# EasyEDA Pro project PowerStack.epro, board PCB1
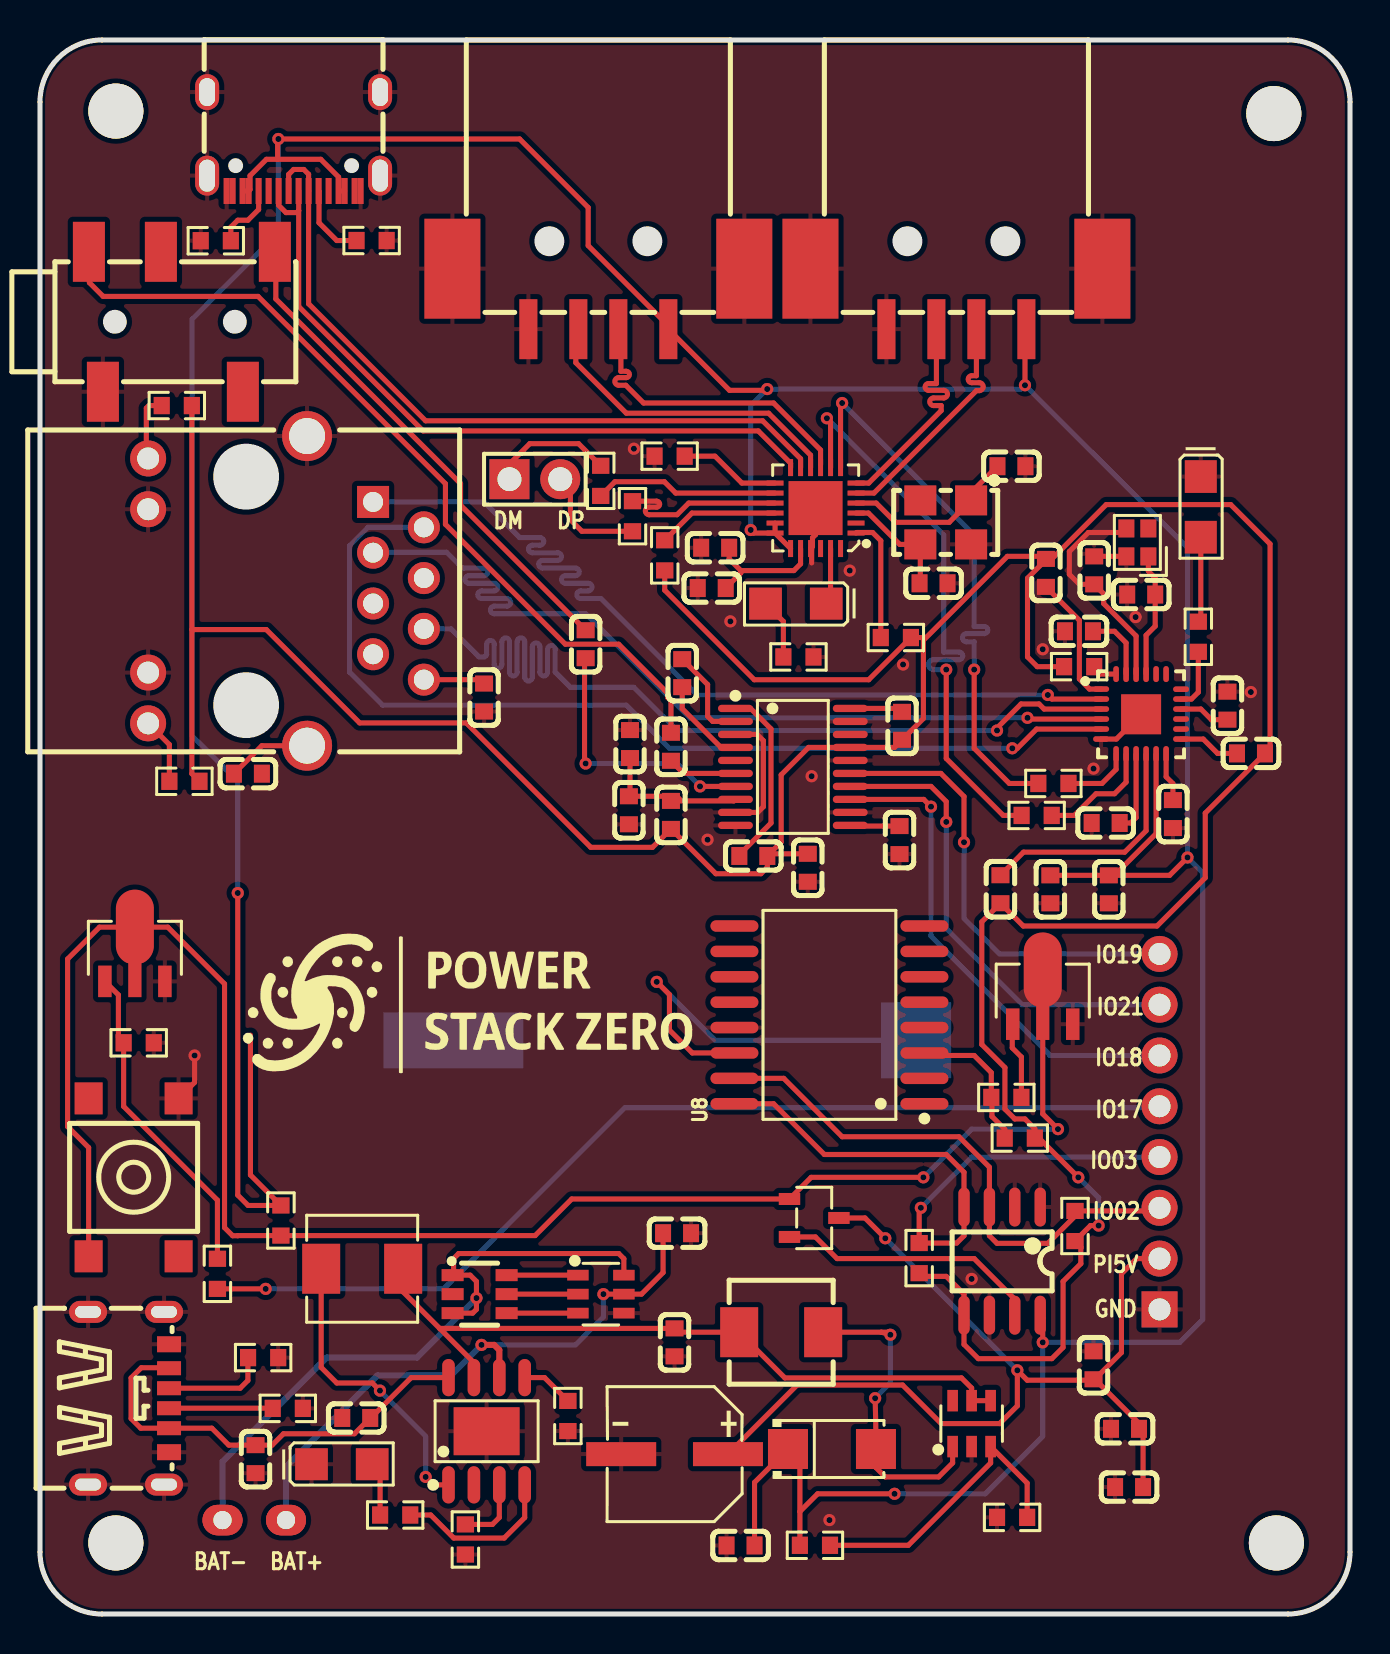
[diagram p1: board, top side]
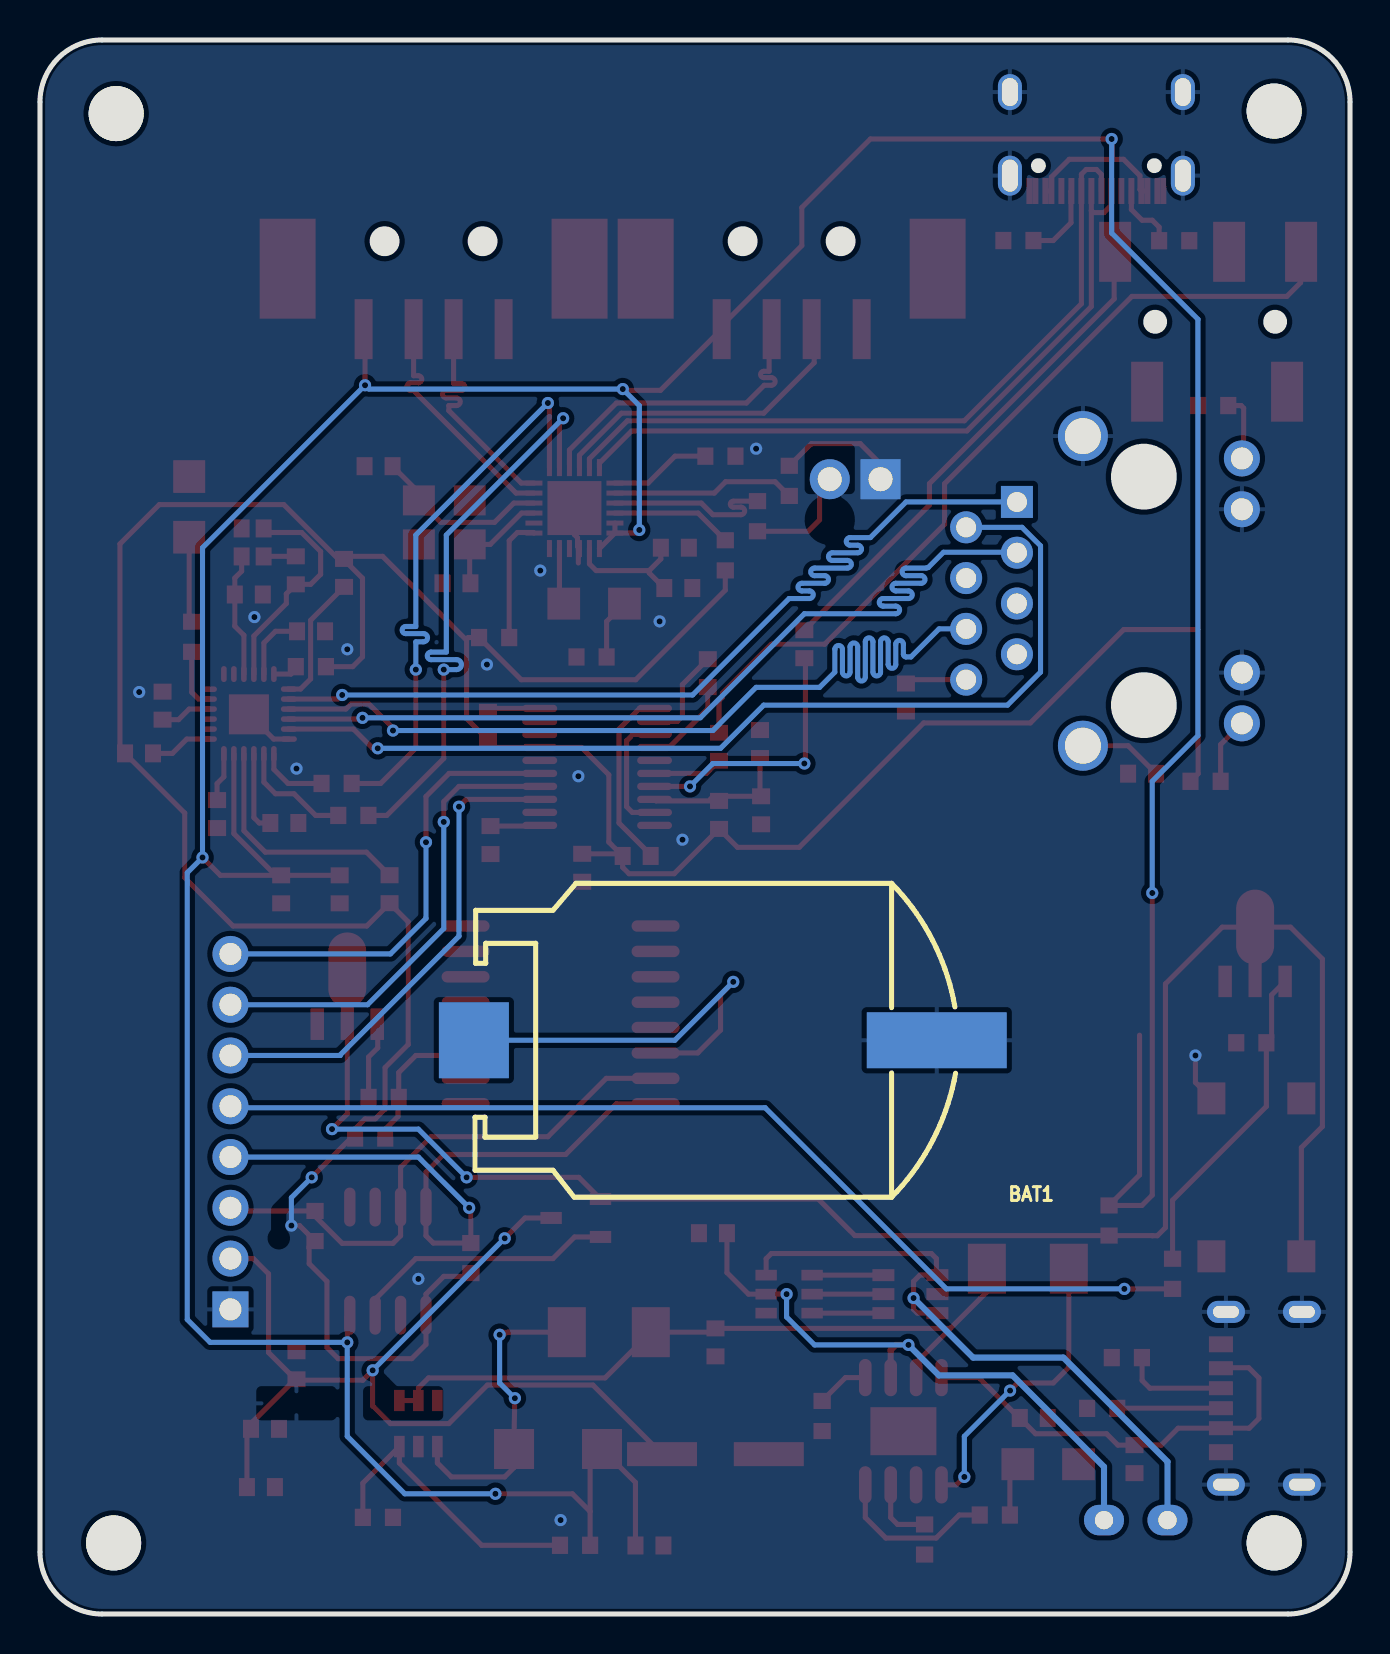
[diagram p2: board, bottom side, seen from below]

Outline 65.52 x 78.74 mm; copper layers: Top Layer, Bottom Layer. Coordinates in mm from the lower left corner of the outline.
Outline path: 0,75.64 0,3.1 arc(0.91,0.91) 3.1,0 62.42,0 arc(64.61,0.91) 65.52,3.1 65.52,75.64 arc(64.61,77.83) 62.42,78.74 3.1,78.74 arc(0.91,77.83) 0,75.64
Stack: Top Layer 0.035mm / Dielectric1 1.51mm FR4 er 4.5 / Bottom Layer 0.035mm

## Design rules (mm)
template: JLCPCB Capability(Two Layers Board)
spacing copperThickness1oz (default): track to track 0.102, other pairs 0.152 to 0.3
spacing copperThickness2oz: track to track 0.203, other pairs 0.152 to 0.3
track width copperThickness1oz (default): min 0.127, default 0.254, max 2.54
track width copperThickness2oz: min 0.203, default 0.254, max 2.54
differential pair differentialPair (default): width min 0.127, default 0.254, max 2.54; gap min 0.152, default 0.152
via viaSize (default): diameter min 0.5, default 0.61, max 10; hole min 0.3, default 0.305, max 6.3

## Placement (name value [footprint] x y rotation side)
BAT1  BS-CR2032-8  [BAT-SMD_BS-CR2032-8]  32.24 28.7 0 bottom
C1  10uF  [C0603]  10.78 7.75 270 top
C2  22uF  [C0603]  15.82 9.81 180 top
C3  10uF  [C0603]  31.73 13.59 270 top
C4  100nF  [C0603]  31.86 19.05 180 top
C5  100nF  [C0603]  54.26 9.27 0 top
C6  10uF  [C0603]  54.47 6.35 180 top
C7  100nF  [C0603]  35.04 3.43 0 top
C8  100nF  [C0603]  52.69 12.44 270 top
C9  470uF  [CAP-SMD_BD6.3-L6.6-W6.6-FD]  31.74 8 180 top
C10  100nF  [C0603]  33.77 53.34 0 top
C11  10uF  [C0603]  33.6 51.32 180 top
C12  22pF  [C0603]  48.58 57.42 180 top
C13  22pF  [C0603]  44.69 51.56 180 top
C14  1uF  [C0603]  53.3 39.57 0 top
C15  100nF  [C0603]  22.21 45.85 270 top
C16  22pF  [C0603]  55.07 51 0 top
C17  22pF  [C0603]  52.72 52.21 270 top
C18  1uF  [C0603]  56.66 40.02 90 top
C19  1uF  [C0603]  51.96 49.16 0 top
C20  1uF  [C0603]  59.39 45.44 270 top
C21  1uF  [C0603]  10.4 42.04 180 top
C22  100nF  [C0603]  50.53 36.25 90 top
C23  10uF  [C0603]  53.45 36.25 270 top
C24  100nF  [C0603]  48.03 36.26 270 top
C25  100nF  [C0603]  60.56 43.05 180 top
C26  100nF  [C0603]  50.31 52.08 90 top
C27  100nF  [C0603]  31.56 39.98 270 top
C28  100nF  [C0603]  43.11 44.43 270 top
C29  1uF  [C0603]  35.67 37.92 0 top
C30  10uF  [C0603]  38.4 37.33 270 top
C31  1uF  [C0603]  42.99 38.72 270 top
C32  2.2uF  [C0603]  31.56 43.38 270 top
C33  2.2uF  [C0603]  27.29 48.51 270 top
C34  100nF  [C0603]  29.51 43.52 270 top
C35  1uF  [C0603]  29.45 40.21 270 top
C36  1uF  [C0603]  32.12 47.07 90 top
CN1  PJ-327A  [AUDIO-SMD_XUNPU_PJ-327A]  7.1 64.64 0 top
D1  SS34  [SMA_L4.3-W2.6-LS5.1-RD]  39.61 8.25 0 top
H1  PZ254V-11-02P  [HDR-TH_2P-P2.54-V-M]  24.75 56.77 0 top
H2  PZ254R-11-08P  [HDR-TH_8P-P2.54-H-M-W10.4]  55.99 24.13 90 top
J1  HR911105A  [RJ45-TH_HR911105A]  12.3 51.18 270 top
L1  2.2uH  [IND-SMD_L5.4-W5.2]  16.11 17.27 0 top
L2  10uH  [IND-SMD_L5.2-W5.2_MCW-0530]  37.07 14.1 0 top
NOREF  -  [Pad_e1323]  3.79 75.18 0 top
NOREF#2  -  [Pad_e1324]  61.71 75.06 0 top
NOREF#3  -  [Pad_e347]  9.13 4.7 180 top
NOREF#4  -  [Pad_e346]  12.3 4.7 180 top
NOREF#5  -  [Pad_e343]  12.3 4.7 180 top
NOREF#6  -  [Pad_e348]  9.13 4.7 180 top
NOREF#7  -  [Pad_e768]  61.83 3.56 0 top
NOREF#8  -  [Pad_e160]  3.79 3.56 0 top
Q1  FS8205A  [SOT-23-6_L2.9-W1.6-P0.95-LS2.8-BR]  21.99 16 180 top
Q2  AO3407  [SOT-23-3_L2.9-W1.6-P1.90-LS2.8-BR]  38.72 19.81 180 top
Q3  2N2222AU  [SOT-89-3_L4.5-W2.4-P1.50-LS4.0-BR]  4.75 33 270 top
Q4  2N2222AU  [SOT-89-3_L4.5-W2.4-P1.50-LS4.0-BR]  50.15 30.86 270 top
R1  10kΩ  [R0603_NEW]  21.27 3.73 90 top
R2  1.8kΩ  [R0603_NEW]  26.4 9.91 90 top
R3  1kΩ  [R0603_NEW]  17.76 4.95 0 top
R5  100kΩ  [R0603_NEW]  38.76 3.44 180 top
R6  20kΩ  [R0603_NEW]  48.62 4.83 0 top
R7  4.7kΩ  [R0603_NEW]  43.97 17.8 270 top
R8  4.7kΩ  [R0603_NEW]  51.76 19.41 90 top
R9  100kΩ  [R0603_NEW]  12.05 19.69 90 top
R10  1kΩ  [R0603_NEW]  8.87 17.02 90 top
R11  10kΩ  [R0603_NEW]  4.94 28.58 180 top
R12  10kΩ  [R0603_NEW]  49 23.81 180 top
R13  1kΩ  [R0603_NEW]  48.33 25.84 0 top
R14  22Ω  [R0603_NEW]  28.04 56.69 270 top
R15  22Ω  [R0603_NEW]  29.63 54.92 90 top
R16  10kΩ  [R0603_NEW]  31.24 52.96 90 top
R17  2.7kΩ  [R0603_NEW]  31.49 57.92 180 top
R18  10kΩ  [R0603_NEW]  42.8 48.85 180 top
R19  1kΩ  [R0603_NEW]  37.93 47.88 0 top
R20  1kΩ  [R0603_NEW]  57.93 48.89 270 top
R21  1kΩ  [R0603_NEW]  6.84 60.45 0 top
R22  1kΩ  [R0603_NEW]  7.22 41.66 0 top
R23  10kΩ  [R0603_NEW]  51.97 47.39 180 top
R24  22Ω  [R0603_NEW]  50.68 41.55 180 top
R25  22Ω  [R0603_NEW]  49.84 39.95 180 top
SW2  B3FS-1000P  [KEY-SMD_4P-L6.0-W6.3-P4.50-LS8.0]  4.68 21.84 90 top
U1  ETA6002E8A  [ESOP-8_L4.9-W3.9-P1.27-LS6.0-BL-EP-1]  22.34 9.14 0 top
U2  MT3608  [SOT-23-6_L2.9-W1.6-P0.95-LS2.8-BL]  46.59 9.53 0 top
U3  INA219BIDR  [SOIC-8_L5.0-W4.0-P1.27-LS6.1-BL]  48.12 17.65 180 top
U4  YLED1206G  [LED1206-RD]  15.1 7.49 0 top
U5  5.1kΩ  [R0603_NEW]  11.16 12.83 180 top
U6  5.1kΩ  [R0603_NEW]  12.39 10.29 180 top
U7  DW01A  [SOT-23-6_L2.9-W1.6-P0.95-LS2.8-BL]  28.05 16 270 top
U8  DS3231SN#T&R  [SOIC-16_L10.3-W7.5-P1.27-LS10.3-BL]  39.48 29.97 90 top
U9  FE1.1S-BQFN24B  [WQFN-24_L4.0-W4.0-P0.50-TL-EP2.7]  38.79 55.32 180 top
U10  5.1kΩ  [R0603_NEW]  8.79 68.7 0 top
U11  5.1kΩ  [R0603_NEW]  16.58 68.71 0 top
U12  RTL8152B  [QFN-24_L4.0-W4.0-P0.50-BL-EP2.0]  55.07 45.02 270 top
U14  YLED1206R  [LED1206-FD]  37.8 50.54 0 top
U15  YLED1206G  [LED1206-RD]  58.05 55.38 270 top
U16  PCM5102APWR  [TSSOP-20_L6.5-W4.4-P0.65-LS6.4-BL]  37.65 42.38 270 top
U17  25MHz  [CRYSTAL-SMD_4P-L2.0-W1.6-BL]  54.88 53.61 90 top
USB1  TYPE-C 6P  [TYPE-C-SMD_TYPE-C-6P_1]  4.43 10.8 270 top
USB2  USB-234-BCW  [USB-A-SMD_USB-234-BCW]  27.92 65.79 180 top
USB4  USB-234-BCW  [USB-A-SMD_USB-234-BCW]  45.83 65.79 180 top
USB5  TYPE C  [USB-C_SMD-TYPE-C-31-M-12]  12.68 73.66 180 top
X1  12MHz  [OSC-SMD_4P-L5.0-W3.2-BL_SG5032]  45.3 54.61 180 top

## Footprints (pads in the part's own frame, mm; a bottom-side part is the same pattern mirrored in y, then rotated)
AUDIO-SMD_XUNPU_PJ-327A
  rect 1.6x3 smd: 2(-4.65,3.5) 3(4.65,3.5) 4(3.05,-3.5) 5(-3.95,-3.5) 6(-1.05,3.5)
BAT-SMD_BS-CR2032-8
  rect 7x2.8 smd: 1(-11.575,0)
  rect 3.5x3.8 smd: 2(11.575,0)
C0603
  rect 0.8x0.9 smd: 1(-0.7,0) 2(0.7,0)
CAP-SMD_BD6.3-L6.6-W6.6-FD
  rect 3.5x1.2 smd: 1(-2.67,0) 2(2.67,0)
CRYSTAL-SMD_4P-L2.0-W1.6-BL
  rect 0.9x0.8 smd: 1(-0.7,-0.55) 2(0.7,-0.55) 3(0.7,0.55) 4(-0.7,0.55)
ESOP-8_L4.9-W3.9-P1.27-LS6.0-BL-EP-1
  oval 0.63x1.865 smd: 1(-1.905,-2.683) 2(-0.635,-2.683) 3(0.635,-2.683) 4(1.905,-2.683) 5(1.905,2.683) 6(0.635,2.683) 7(-0.635,2.683) 8(-1.905,2.683)
  rect 3.3x2.4 smd: 9(0,0)
HDR-TH_2P-P2.54-V-M
  rect 2x2 hole 1.2: 1(-1.27,0)
  round 2 hole 1.2: 2(1.27,0)
HDR-TH_8P-P2.54-H-M-W10.4
  rect 1.8x1.8 hole 1.1: 1(-8.89,0)
  round 1.8 hole 1.1: 2(-6.35,0) 3(-3.81,0) 4(-1.27,0) 5(1.27,0) 6(3.81,0) 7(6.35,0) 8(8.89,0)
IND-SMD_L5.2-W5.2_MCW-0530
  rect 1.9x2.5 smd: 1(-2.1,0) 2(2.1,0)
IND-SMD_L5.4-W5.2
  rect 1.9x2.5 smd: 1(2.05,0) 2(-2.05,0)
KEY-SMD_4P-L6.0-W6.3-P4.50-LS8.0
  rect 1.6x1.4 smd: 1(3.95,-2.25) 2(-3.95,-2.25) 3(3.95,2.25) 4(-3.95,2.25)
LED1206-FD
  rect 1.635x1.6 smd: 1(-1.518,0) 2(1.518,0)
LED1206-RD
  rect 1.635x1.6 smd: 1(-1.518,0) 2(1.518,0)
OSC-SMD_4P-L5.0-W3.2-BL_SG5032
  rect 1.6x1.5 smd: 1(-1.27,-1.1) 2(1.27,-1.1) 3(1.27,1.1) 4(-1.27,1.1)
Pad_e160
  round 2.75 hole 2.75: None(0,0)
Pad_e343
  oval 2x1.524 hole 0.914: 1(0,0)
Pad_e346
  oval 2x1.524 smd: 1(0,0)
Pad_e347
  oval 2x1.524 hole 0.914: 1(0,0)
Pad_e348
  oval 2x1.524 smd: 1(0,0)
Pad_e768
  round 2.75 hole 2.75: None(0,0)
Pad_e1323
  round 2.75 hole 2.75: None(0,0)
Pad_e1324
  round 2.75 hole 2.75: None(0,0)
QFN-24_L4.0-W4.0-P0.50-BL-EP2.0
  oval 0.28x0.8 smd: 1(-1.25,-2) 2(-0.75,-2) 3(-0.25,-2) 4(0.25,-2) 5(0.75,-2) 6(1.25,-2) 13(1.25,2) 14(0.75,2) 15(0.25,2) 16(-0.25,2) 17(-0.75,2) 18(-1.242,2)
  oval 0.8x0.28 smd: 7(2,-1.25) 8(2,-0.75) 9(2,-0.25) 10(2,0.25) 11(2,0.75) 12(2,1.25) 19(-2,1.25) 20(-2,0.75) 21(-2,0.25) 22(-2,-0.25) 23(-2,-0.75) 24(-2,-1.25)
  rect 2x2 smd: 25(0.013,0)
R0603_NEW
  rect 0.806x0.864 smd: 1(-0.753,0) 2(0.753,0)
RJ45-TH_HR911105A
  rect 1.6x1.6 hole 1: 1(-4.45,4.355)
  round 1.6 hole 1: 2(-3.18,6.895) 3(-1.91,4.355) 4(-0.64,6.895) 5(0.63,4.355) 6(1.9,6.895) 7(3.17,4.355) 8(4.44,6.895)
  round 1.8 hole 1.1: 9(-6.625,-6.895) 10(-4.085,-6.895) 11(4.085,-6.895) 12(6.625,-6.895)
  round 2.5 hole 1.8: SH1(-7.745,1.055) SH2(7.745,1.055)
SMA_L4.3-W2.6-LS5.1-RD
  rect 2x2 smd: 1(-2.2,0) 2(2.2,0)
SOIC-8_L5.0-W4.0-P1.27-LS6.1-BL
  oval 0.569x1.95 smd: 1(-1.905,-2.705) 2(-0.635,-2.705) 3(0.635,-2.705) 4(1.905,-2.705) 5(1.905,2.705) 6(0.635,2.705) 7(-0.635,2.705) 8(-1.905,2.705)
SOIC-16_L10.3-W7.5-P1.27-LS10.3-BL
  oval 0.574x2.401 smd: 1(-4.445,-4.75) 2(-3.175,-4.75) 3(-1.905,-4.75) 4(-0.635,-4.75) 5(0.635,-4.75) 6(1.905,-4.75) 7(3.175,-4.75) 8(4.445,-4.75) 9(4.445,4.75) 10(3.175,4.75) 11(1.905,4.75) 12(0.635,4.75) 13(-0.635,4.75) 14(-1.905,4.75) 15(-3.175,4.75) 16(-4.445,4.75)
SOT-23-3_L2.9-W1.6-P1.90-LS2.8-BR
  rect 1.07x0.6 smd: 1(1.235,-0.95) 2(1.235,0.95) 3(-1.235,0)
SOT-23-6_L2.9-W1.6-P0.95-LS2.8-BL
  rect 0.532x1.072 smd: 1(-0.95,-1.149) 2(0,-1.149) 3(0.95,-1.149) 4(0.95,1.149) 5(0,1.149) 6(-0.95,1.149)
SOT-23-6_L2.9-W1.6-P0.95-LS2.8-BR
  rect 1.1x0.6 smd: 1(1.35,-0.95) 2(1.35,0) 3(1.35,0.95) 4(-1.35,0.95) 5(-1.35,0) 6(-1.35,-0.95)
SOT-89-3_L4.5-W2.4-P1.50-LS4.0-BR
  rect 1.575x0.672 smd: 1(1.357,-1.5) 3(1.357,1.5)
  custom 5.377x1.9 smd: 2(-1.357,-0.001)
TSSOP-20_L6.5-W4.4-P0.65-LS6.4-BL
  oval 0.364x1.742 smd: 1(-2.925,-2.871) 2(-2.275,-2.871) 3(-1.625,-2.871) 4(-0.975,-2.871) 5(-0.325,-2.871) 6(0.325,-2.871) 7(0.975,-2.871) 8(1.625,-2.871) 9(2.275,-2.871) 10(2.925,-2.871) 11(2.925,2.871) 12(2.275,2.871) 13(1.625,2.871) 14(0.975,2.871) 15(0.325,2.871) 16(-0.325,2.871) 17(-0.975,2.871) 18(-1.625,2.871) 19(-2.275,2.871) 20(-2.925,2.871)
TYPE-C-SMD_TYPE-C-6P_1
  oval 1.1x1.9 hole 0.6x1.3: 7(-4.32,1.775) 7(-4.32,-2.025) 7(4.32,1.775) 7(4.32,-2.025)
  rect 0.7x1.2 smd: A5(-0.5,2.025) A9(1.5,2.025) B5(0.5,2.025) B9(-1.5,2.025)
  rect 0.8x1.2 smd: A12(2.7,2.025) B12(-2.7,2.025)
USB-A-SMD_USB-234-BCW
  rect 0.9x3 smd: 1(-3.5,1.512) 2(-1,1.512) 3(1,1.512) 4(3.5,1.512)
  rect 2.8x5 smd: 5(-7.3,-1.512) 6(7.3,-1.512)
USB-C_SMD-TYPE-C-31-M-12
  oval 1.2x2 hole 0.8x1.6: 0(-4.325,1.706) 1(4.325,1.706)
  oval 1.2x1.8 hole 0.8x1.4: 2(4.325,-2.474) 3(-4.325,-2.474)
  rect 0.3x1.3 smd: A1(-3.35,2.474) A4(-2.55,2.474) A5(-1.25,2.474) A6(-0.25,2.474) A7(0.25,2.474) A8(1.25,2.474) A9(2.55,2.474) A12(3.35,2.474) B1(3.05,2.474) B4(2.25,2.474) B5(1.75,2.474) B6(0.75,2.474) B7(-0.75,2.474) B8(-1.75,2.474) B9(-2.25,2.474) B12(-3.05,2.474)
WQFN-24_L4.0-W4.0-P0.50-TL-EP2.7
  rect 0.85x0.25 smd: 1(-2.025,1.25) 2(-2.025,0.75) 3(-2.025,0.25) 4(-2.025,-0.25) 5(-2.025,-0.75) 6(-2.025,-1.25) 13(2.025,-1.25) 14(2.025,-0.75) 15(2.025,-0.25) 16(2.025,0.25) 17(2.025,0.75) 18(2.025,1.25)
  rect 0.25x0.85 smd: 7(-1.25,-2.025) 8(-0.75,-2.025) 9(-0.25,-2.025) 10(0.25,-2.025) 11(0.75,-2.025) 12(1.25,-2.025) 19(1.25,2.025) 20(0.75,2.025) 21(0.25,2.025) 22(-0.25,2.025) 23(-0.75,2.025) 24(-1.25,2.025)
  rect 2.7x2.7 smd: 25(0.001,0)

## Nets
As in the schematic, except:
BAT+: C4.2 NOREF#4.1 NOREF#5.1 U1.6 U7.5
BAT-: NOREF#3.1 NOREF#6.1 Q1.1 Q1.3 U7.6

Pads without a net: C18 2; C21 1 2; CN1 4 6; J1 4 5 7; NOREF None; NOREF#2 None; NOREF#7 None; NOREF#8 None; Q1 2; SW2 2 3; U2 6; U8 1 2 4 5 6 7 8 9 10 11 12; U9 2 22 24; U12 14 15 18 19 20; U16 5 18; U17 2; USB5 A8 B8; X1 2

## Via types
v1: diameter 0.61, hole 0.305, Top Layer to Bottom Layer, 50 vias

## Routing (per net, layer and track width the routed paths; a pad name or vN(x,y) marks a point on that pad's centre or on a via; arc(x,y) is an arc through that point)
5V_OUT: length 236.2
  Top Layer w0.254: 11.88,72.77 11.88,73.75 v1(11.92,73.79) ; 11.88,72.77 14.04,72.77 14.93,71.88 USB5.B9 USB5.A4 ; 11.88,72.77 11.33,72.77 10.51,71.95 10.51,71.26 USB5.B4 USB5.A9 ; 53.73,36.95 C22.2 ; 53.73,36.95 56.49,36.95 v1(57.39,37.85) ; 53.73,36.95 55.82,39.04 U12.11 ; v1(49.26,61.47) 49.26,64.2 USB4.1 ; U9.18 U9.19 ; U9.18 35.7,54.07 v1(35.54,54.23) ; U9.18 U9.17 ; v1(36.37,61.28) 36.31,61.21 34.48,61.21 USB2.1 31.42,64.45 27.42,68.45 27.42,70.36 23.99,73.79 v1(11.92,73.79) ; 11.84,73.79 v1(11.92,73.79) ; R5.2 38,5.13 ; 38,5.13 38.89,6.01 v1(42.74,6.01) ; 38,5.13 38,8.25 37.41,8.25 35.74,6.58 C7.2 ; v1(9.89,36.07) 9.89,20.96 10.41,20.44 R9.2 10.52,21.96 10.52,28.96 ; v1(50.15,13.59) 50.15,14.82 U3.8
  Bottom Layer w0.254: v1(35.54,54.23) 35.54,60.45 v1(36.37,61.28) 49.07,61.28 v1(49.26,61.47) 57.39,53.34 v1(57.39,37.85) 58.15,37.08 58.15,14.73 57.01,13.59 v1(50.15,13.59) 50.15,8.89 47.27,6.01 v1(42.74,6.01) ; v1(9.89,36.07) 9.89,41.66 7.6,43.94 7.6,64.77 11.92,69.09 v1(11.92,73.79)
+5V: length 22
  Top Layer w0.254: USB1.B9 6.43,12.32 5.06,12.32 4.56,11.81 4.56,9.78 5.04,9.3 USB1.A9 8.6,9.3 9.44,8.45 C1.1 11.61,8.45 12.18,9.02 15.73,9.02 C2.1 16.54,9.81 18.56,11.83 U1.8
AVDD: length 7.8
  Top Layer w0.254: 31.99,40.77 31.85,40.91 C35.1 29.51,40.96 C34.2 ; C27.1 34.7,40.68 U16.8
GND: length 15.8
  Top Layer w0.254: C17.1 54.33,52.91 U17.4 ; U9.25 38.79,53.99 38.63,53.84 38.63,53.4 U9.21 38.59,53.24 38.59,52.58 ; SW2.1 7.73,26.59 v1(7.73,27.94) ; U16.3 35.87,44 36.18,43.69 36.18,40.39 35.89,40.1 U16.9 ; U12.6 53.83,43.77 U12.25
  vias: v1(29.7,58.29) v1(33.39,38.73) v1(34.53,49.66) v1(38.59,41.91) v1(39.48,4.7) v1(40.5,52.2) v1(43.16,47.5) v1(46.59,16.76) v1(50.15,48.26) v1(52.69,42.29) v1(54.79,49.87) v1(60.56,46.12)
(no net): length 6.9
  Top Layer w0.254: 13.36,43.44 11.1,43.44 9.7,42.04 ; 56.32,43.23 56.32,41.88 56.66,41.54 C18.2
BAT+: length 30.6
  Top Layer w0.254: C4.2 31.16,17.08 30.08,16 U7.5 v1(28.18,16)
  Top Layer w0.305: v1(22.08,13.46) 22.72,13.46 22.97,13.21 U1.6
  Bottom Layer w0.254: v1(22.08,13.46) 26.78,13.46 28.18,14.86 v1(28.18,16)
  Bottom Layer w0.305: NOREF#4.1 12.3,7.37 16.88,11.94 20.56,11.94 v1(22.08,13.46)
BAT-: length 33.4
  Top Layer w0.254: U7.6 29.2,17.77 28.94,18.03 20.94,18.03 20.69,17.78 20.69,17 Q1.1 21.51,16.95 21.83,16.64 v1(21.83,15.81) 21.83,15.24 21.64,15.05 Q1.3
  Bottom Layer w0.305: NOREF#3.1 9.13,7.62 14.33,12.83 18.85,12.83 v1(21.83,15.81)
DM1: length 36.8
  Top Layer w0.254: U9.11 38.04,57.79 36.14,59.69 19.29,59.69 13.43,65.54 USB5.B7 13.43,72.02 13.19,72.26 12.68,72.26 12.43,72.01 USB5.A7
DM2: length 16.1
  Top Layer w0.254: 39.04,57.51 39.04,58.23 36.69,60.58 30.19,60.58 29.3,61.47 28.94,61.47 arc(28.75,61.66) 28.94,61.85 29.32,61.85 arc(29.48,62.01) 29.32,62.17 29.05,62.17 29.05,64.15 USB2.2
DM3: length 29.4
  Top Layer w0.254: U9.7 40.04,60.5 v1(40.12,60.58) ; v1(46.72,47.24) 46.72,43.31 48.48,41.55 49.93,41.55
  Bottom Layer w0.254: v1(46.72,47.24) 46.72,48.63 46.34,48.63 arc(46.13,48.84) 46.34,49.04 47.23,49.04 arc(47.41,49.22) 47.23,49.4 46.72,49.4 46.72,53.98 v1(40.12,60.58)
DM4: length 12.5
  Top Layer w0.254: 46.83,64.38 46.83,61.94 46.59,61.94 arc(46.42,61.77) 46.59,61.59 46.97,61.59 arc(47.17,61.4) 46.97,61.2 46.83,61.2 41.71,56.07 U9.5
DP1: length 35.8
  Top Layer w0.254: 12.94,70.2 12.94,65.41 19.16,59.18 35.92,59.18 37.54,57.57 U9.12 ; 12.94,70.2 12.94,71.18 USB5.A6 ; 12.94,70.2 12.84,70.1 12.3,70.1 11.93,70.47 USB5.B6
DP2: length 16
  Top Layer w0.254: USB2.3 26.8,64.15 26.8,62.59 29.32,60.07 36.44,60.07 38.54,57.97 U9.10
DP3: length 30.1
  Top Layer w0.254: v1(45.32,47.24) 45.32,42.8 48.17,39.95 R25.2 ; U9.8 39.54,59.63 v1(39.35,59.82)
  Bottom Layer w0.254: v1(45.32,47.24) 44.69,47.24 arc(44.44,47.49) 44.69,47.74 45.96,47.74 arc(46.15,47.93) 45.96,48.12 45.2,48.12 45.2,53.98 v1(39.35,59.82)
DP4: length 12.5
  Top Layer w0.254: U9.6 41.45,56.57 45.07,60.2 45.07,60.45 44.69,60.45 arc(44.5,60.64) 44.69,60.83 45.2,60.83 arc(45.39,61.02) 45.2,61.21 44.43,61.21 arc(44.26,61.38) 44.43,61.55 44.83,61.55 USB4.3
E-XIN: length 6.2
  Top Layer w0.254: U12.21 55.32,48.96 55.77,49.42 C16.2 55.77,51.82 55.43,52.17 U17.1
E-XO: length 11.3
  Top Layer w0.254: U17.3 54.13,54.1 52.43,54.1 51.48,53.15 51.48,52.01 51.98,51.51 C17.2 53.2,51.03 53.2,50.55 54.82,48.92 U12.22
GPIO02: length 27.6
  Top Layer w0.254: H2.3 55.83,20.16 R8.2 51.76,19.9 50.4,18.54 47.86,18.54 47.48,18.92 U3.3 47.48,22.35 45.96,23.88 40.12,23.88 37.2,26.8 U8.15
GPIO03: length 33.3
  Top Layer w0.254: v1(44.05,20.32) 43.97,20.24 R7.1 45.85,18.56 46.21,18.92 U3.4 46.21,22.1 45.32,22.99 39.23,22.99 36.69,25.53 34.73,25.53
  Bottom Layer w0.254: v1(44.05,20.32) 46.59,22.86 H2.4
GPIO17: length 50.9
  Top Layer w0.254: R10.1 v1(11.29,16.26)
  Bottom Layer w0.254: v1(11.29,16.26) 20.19,16.26 29.25,25.33 55.92,25.33 H2.5
GPIO18: length 24.6
  Top Layer w0.254: v1(44.56,40.39) 44.2,40.75 U16.13
  Bottom Layer w0.254: 50.53,27.94 H2.6 ; 50.53,27.94 44.56,33.91 v1(44.56,40.39) ; 50.53,27.94 50.49,27.94
GPIO19: length 22.8
  Top Layer w0.254: U16.15 45.05,42.05 46.21,40.89 v1(46.21,38.61)
  Bottom Layer w0.254: H2.8 47.99,33.02 46.21,34.8 v1(46.21,38.61)
GPIO21: length 23.7
  Top Layer w0.254: U16.14 44.56,41.4 45.32,40.64 v1(45.32,39.62)
  Bottom Layer w0.254: v1(45.32,39.62) 45.32,34.29 49.13,30.48 H2.7
MDIN0: length 51
  Top Layer w0.254: U12.3 50.22,45.27 49.96,45.52 49.06,45.52 47.86,44.32 v1(47.86,44.2)
  Bottom Layer w0.254: v1(47.86,44.2) 31.86,44.2 29.7,46.36 26.53,46.36 25.77,47.12 25.77,48.26 arc(25.57,48.45) 25.38,48.26 25.38,47.12 arc(25.19,46.93) 25,47.12 25,48.39 arc(24.81,48.58) 24.62,48.39 24.62,46.86 arc(24.43,46.67) 24.24,46.86 24.24,48.64 arc(24.05,48.83) 23.86,48.64 23.86,47.12 arc(23.67,46.93) 23.48,47.12 23.48,48.64 arc(23.29,48.83) 23.1,48.64 23.1,47.5 arc(22.91,47.31) 22.72,47.5 22.72,48.51 arc(22.53,48.7) 22.34,48.51 22.34,48.01 arc(22.3,47.92) 22.21,47.88 21.95,47.88 20.55,49.28 J1.6
MDIN1: length 50
  Top Layer w0.254: U12.5 49.84,44.27 48.88,43.31 v1(48.63,43.31)
  Bottom Layer w0.254: J1.2 16.4,54.36 15.48,53.44 15.48,47.12 17.13,45.47 29.32,45.47 31.48,43.31 v1(48.63,43.31)
MDIP0: length 48.1
  Top Layer w0.254: v1(50.4,45.97) 50.61,45.77 U12.2
  Bottom Layer w0.254: v1(50.4,45.97) 32.88,45.97 28.05,50.8 27.04,50.8 arc(26.84,50.99) 27.04,51.18 27.42,51.18 arc(27.61,51.37) 27.42,51.56 26.27,51.56 arc(26.08,51.75) 26.27,51.94 26.78,51.94 arc(26.97,52.13) 26.78,52.32 25.13,52.32 arc(24.94,52.51) 25.13,52.71 25.89,52.71 arc(26.08,52.9) 25.89,53.09 24.62,53.09 arc(24.43,53.28) 24.62,53.47 25,53.47 arc(25.19,53.66) 25,53.85 23.99,53.85 22.2,55.63 16.66,55.63
MDIP1: length 46.6
  Top Layer w0.254: U12.4 49.45,44.77 v1(49.39,44.83)
  Bottom Layer w0.254: v1(49.39,44.83) 32.5,44.83 27.29,50.04 22.72,50.04 arc(22.53,50.23) 22.72,50.42 23.35,50.42 arc(23.54,50.61) 23.35,50.8 22.08,50.8 arc(21.89,50.99) 22.08,51.18 22.72,51.18 arc(22.91,51.37) 22.72,51.56 21.45,51.56 arc(21.26,51.75) 21.45,51.94 22.21,51.94 arc(22.4,52.13) 22.21,52.32 21.19,52.32 arc(21.14,52.33) 21.09,52.35 20.33,53.11 16.68,53.11 J1.3
MOSFET_GATE: length 89.5
  Top Layer w0.254: SW2.4 2.43,23.33 1.38,24.38 1.38,32.77 2.98,34.36 Q3.2 6.39,34.36 9.23,31.52 9.23,19.33 9.64,18.92 9.89,18.92 9.9,18.93 R9.1 24.76,18.93 26.59,20.76 Q2.1 38.57,21.84 v1(44.18,21.84) ; v1(50.91,24.26) 50.15,25.02 Q4.2
  Bottom Layer w0.254: v1(44.18,21.84) 46.59,24.26 v1(50.91,24.26)
MOSFET_IN: length 13.4
  Top Layer w0.254: Q2.2 38.78,18.86 39.86,17.78 46.72,17.78 48.75,15.75 U3.7
PI_3V3: length 185.2
  Top Layer w0.254: v1(52.94,19.43) 52.54,19.43 51.76,18.66 52.05,18.36 52.05,17.53 51.17,16.64 51.17,13.34 50.6,12.77 46.92,12.77 46.21,13.49 U3.5 46.21,16 45.32,16.89 44.13,16.89 R7.2 ; 44.24,48.77 48.38,52.91 50.48,52.91 50.35,52.78 ; C26.2 50.35,52.78 ; 50.35,52.78 49.39,51.82 49.39,47.88 49.88,47.39 R23.2 ; 50.35,52.78 50.61,52.78 53.32,55.5 59.55,55.5 61.52,53.53 61.52,43.31 58.28,40.07 58.28,36.83 55.86,34.42 49.17,34.42 C24.2 47.1,34.62 47.1,28.49 48.26,27.33 48.26,25.26 48.75,24.77 49.26,24.77 49.75,24.27 R12.1 49.96,23.81 v1(51.93,21.84) ; R22.2 7.6,42.04 7.6,49.25 ; 36.48,38.03 C29.2 36.38,37.35 36.06,37.03 33.8,37.03 C27.2 30.63,38.35 27.54,38.35 21.32,44.58 15.99,44.58 11.32,49.25 7.6,49.25 ; 36.48,38.03 C30.1 ; 36.48,38.03 37.07,38.61 37.07,41.98 38.44,43.35 42.73,43.35 44.18,44.8 44.18,48.77 44.1,48.85 R18.1 41.45,46.74 35.72,46.74 31.24,51.22 R16.1 ; R21.2 7.6,49.25
  Bottom Layer w0.254: v1(51.93,21.84) 52.94,20.83 v1(52.94,19.43)
PI_5V: length 49.2
  Top Layer w0.254: Q2.3 41.26,19.81 v1(42.27,18.8) ; 52.8,11.7 49.37,11.7 v1(48.88,12.19) 48.88,10.41 47.99,9.53 45.07,9.53 43.14,11.46 37.86,11.46 C9.1 ; 52.8,11.7 54.96,9.54 ; 52.8,11.7 52.8,11.8 54.09,13.08 54.09,17.02 54.85,17.78 H2.2 ; 54.96,9.27 55.17,9.06 C6.1
  Bottom Layer w0.254: v1(48.88,12.19) v1(42.27,18.8)
PI_USB_D+: length 9.2
  Top Layer w0.254: U9.15 32.44,55.57 31.86,54.99 30.46,54.99 arc(30.27,55.18) 30.46,55.37 30.85,55.37 arc(30.99,55.52) 30.85,55.67 R15.2
PI_USB_D-: length 9.2
  Top Layer w0.254: R14.2 28.75,56.64 31.23,56.64 31.79,56.07 U9.14
SYS: length 37
  Top Layer w0.254: U1.7 21.7,12.57 19.99,14.29 ; U2.4 U2.5 46.59,11.3 46.08,11.81 37.25,11.81 L2.1 31.61,14.1 31.42,14.29 ; 19.99,14.29 18.16,16.11 L1.1 ; 19.99,14.29 31.42,14.29 ; 31.42,14.29 31.73,14.29 ; 31.73,14.29 31.42,14.29
USBDM: length 6.2
  Top Layer w0.254: H1.1 23.48,57.53 24.49,58.55 26.93,58.55 R14.1
USBDP: length 5.6
  Top Layer w0.254: R15.1 27.1,54.16 26.53,54.74 26.53,56.26 H1.2
VD33F: length 6.5
  Top Layer w0.254: U9.20 38.04,52.53 37.7,52.2 35.05,52.2 ; 35.05,52.2 35.05,52.08 C11.1 ; 35.05,52.2 34.47,52.78 C10.2
XIN: length 8.9
  Top Layer w0.254: C12.2 46.57,56.1 X1.1 45.47,54.61 42.78,54.61 41.82,55.57 U9.4
XO: length 5.8
  Top Layer w0.254: C13.2 44.03,51.6 X1.3 43,53.51 41.43,55.07 U9.3
$1N1279: length 3.5
  Top Layer w0.254: R1.2 22.63,4.48 22.97,4.83 U1.3
$1N1380: length 2.6
  Top Layer w0.254: U1.5 25.23,11.83 R2.2
$1N1510: length 14.9
  Top Layer w0.254: U1.1 19.68,6.46 v1(19.29,6.86) ; v1(17,11.18) 16.62,11.56 14.84,11.56 14.06,12.34 L1.2
  Bottom Layer w0.254: v1(17,11.18) 19.29,8.89 v1(19.29,6.86)
$1N1640: length 8.3
  Top Layer w0.254: U1.4 24.24,4.83 23.21,3.8 20.7,3.8 19.54,4.95 R3.2
$1N1679: length 2.7
  Top Layer w0.254: R3.1 17.01,7.1 U4.2
$1N1985: length 5.2
  Top Layer w0.254: USB1.B5 11.63,10.3 U6.2
$1N2024: length 5.3
  Top Layer w0.254: U5.2 10.4,12.82 10.4,11.68 10.01,11.3 USB1.A5
$1N2146: length 3.6
  Top Layer w0.254: Q1.4 U7.3
$1N2148: length 3.6
  Top Layer w0.254: Q1.5 U7.2
$1N2150: length 3.6
  Top Layer w0.254: Q1.6 U7.1
$1N2988: length 16
  Top Layer w0.254: L2.2 42.07,14.1 ; 42.07,14.1 42.4,14.1 v1(42.53,13.97) arc(42.3,14.04) 42.07,14.1 ; U2.1 45.64,7.56 44.94,6.86 42.27,6.86 41.81,7.33 D1.2 arc(41.8,9.53) v1(41.77,10.8)
  Bottom Layer w0.254: v1(42.53,13.97) 42.53,11.56 v1(41.77,10.8)
$1N3311: length 14.9
  Top Layer w0.254: 49.37,4.83 49.37,6.55 U2.3 47.54,7.55 43.43,3.44 R5.1
$1N4067: length 20.6
  Top Layer w0.254: U8.14 32.62,28.07 31.48,29.21 31.48,30.99 v1(30.85,31.62)
  Bottom Layer w0.254: BAT1.2 33.77,28.7 v1(30.85,31.62)
$1N4875: length 16.2
  Top Layer w0.254: R10.2 8.87,20.7 4.18,25.39 R11.2 3.92,28.84 3.92,30.97 Q3.1
$1N5005: length 7.3
  Top Layer w0.254: R12.2 48.25,24.25 47.61,24.89 47.61,25.81 R13.1 47.58,27.08 46.72,27.94 44.36,27.94 U8.3
$1N5104: length 3.9
  Top Layer w0.254: R13.2 49.08,27.86 48.63,28.32 48.63,29.48 Q4.1
$1N6233: length 6.1
  Top Layer w0.254: R16.2 32.61,55.07 U9.16
$1N6272: length 5.1
  Top Layer w0.254: R17.1 33.76,57.92 35.1,56.57 U9.13
$1N8172: length 6.3
  Top Layer w0.254: R18.2 42.05,53.69 41.64,54.1 40.84,54.1 U9.1
$1N8859: length 3.8
  Top Layer w0.254: USB5.A5 13.95,71.17 13.95,69.6 14.84,68.71 U11.1
$1N8861: length 3.4
  Top Layer w0.254: USB5.B5 10.93,70.26 10.4,69.72 9.89,69.72 9.55,69.38 U10.2
$1N12231: length 3
  Top Layer w0.254: U14.1 37.18,49.65 37.18,47.88
$1N12235: length 2.8
  Top Layer w0.254: U9.23 39.54,50.76 U14.2
$1N12356: length 4.3
  Top Layer w0.254: R20.1 58.05,49.76 U15.2
$1N12384: length 3
  Top Layer w0.254: R20.2 57.93,46.11 57.59,45.77 U12.17
$1N12475: length 4.1
  Top Layer w0.254: U12.9 54.82,39.84 54.55,39.57 C14.2
$1N13206: length 3.3
  Top Layer w0.254: 5.41,44.56 6.47,43.49 R22.1
$1N13219: length 3.4
  Top Layer w0.254: 5.41,57.81 5.32,57.9 5.32,60.33 5.45,60.45 R21.1
$1N13595: length 3.5
  Top Layer w0.254: 52.66,49.29 52.79,49.16 53.74,49.16 54.32,48.58 U12.23
$1N13631: length 2.5
  Top Layer w0.254: C20.2 58.59,44.74 58.06,45.27 U12.16
$1N13695: length 1.4
  Top Layer w0.254: 52.6,47.39 52.97,47.02 U12.24
$1N14319: length 12
  Top Layer w0.254: U12.10 55.32,39.18 54.25,38.11 49.19,38.11 C24.1
$1N14359: length 3.1
  Top Layer w0.254: U12.13 58.17,43.77 58.89,43.05 C25.2
$1N14433: length 6.6
  Top Layer w0.254: C26.1 51.98,49.71 51.98,46.78 52.49,46.27 U12.1
$1N17533: length 2.7
  Top Layer w0.254: U16.20 42.94,45.3 C28.1
$1N17800: length 2.5
  Top Layer w0.254: U16.11 40.56,39.42 C31.1
$1N17886: length 3.5
  Top Layer w0.254: U16.6 32.19,42.05 C32.2
$1N17922: length 13.2
  Top Layer w0.254: U16.7 v1(33.01,41.4) ; v1(27.29,42.55) 27.23,42.6 27.23,47.77
  Bottom Layer w0.254: v1(27.29,42.55) 31.86,42.55 v1(33.01,41.4)
$1N18109: length 42.2
  Top Layer w0.254: CN1.2 2.47,68.12 2.47,66.6 3.16,65.91 10.91,65.91 20.28,56.54 20.28,54.51 26.27,48.51 28.94,48.51 31.39,46.06 31.39,45.85 31.55,45.69 ; C32.1 31.56,45.69
$1N18113: length 25.5
  Top Layer w0.254: CN1.3 11.8,68.09 11.8,65.79 21.03,56.55 21.03,55.47 27.23,49.27 ; 27.23,49.17 27.23,49.27 ; 27.23,49.27 C33.1
$1N18349: length 9.2
  Top Layer w0.254: C29.1 34.98,37.98 36.56,39.57 36.56,44.28 35.53,45.3 U16.1
$1N18392: length 4.5
  Top Layer w0.254: 34.78,43.35 34.05,43.35 32.12,45.29 C36.1
$1N18397: length 4.9
  Top Layer w0.254: 34.78,44.65 33.64,44.65 33.39,44.91 33.39,46.5 C36.2
$1N32522: length 3.4
  Top Layer w0.254: R24.1 53.11,41.55 53.82,42.26 U12.7
$1N32526: length 5.8
  Top Layer w0.254: U12.8 54.32,41.61 53.74,41.03 52.81,41.03 51.73,39.95 R25.1
$1N46446: length 3.1
  Top Layer w0.254: J1.8 22.02,46.74 C15.1

## Copper pours and planes (outline as drawn; the poured copper is in the pictures)
GND on Top Layer: -12.72,92.71 82.28,92.71 82.28,-25.27 -12.72,-25.27
GND on Bottom Layer: -18.18,89.34 76.82,89.34 76.82,-28.64 -18.18,-28.64

## Text on the board
Top Silkscreen Layer: BAT- | BAT+ | DM | DP | IO03 | IO02 | PI5V | GND | IO18 | IO19 | IO17 | IO21
